# Altium schematic sheet Sheet1.SchDoc
size A4; SheetNumber: 1; SheetTotal: 3
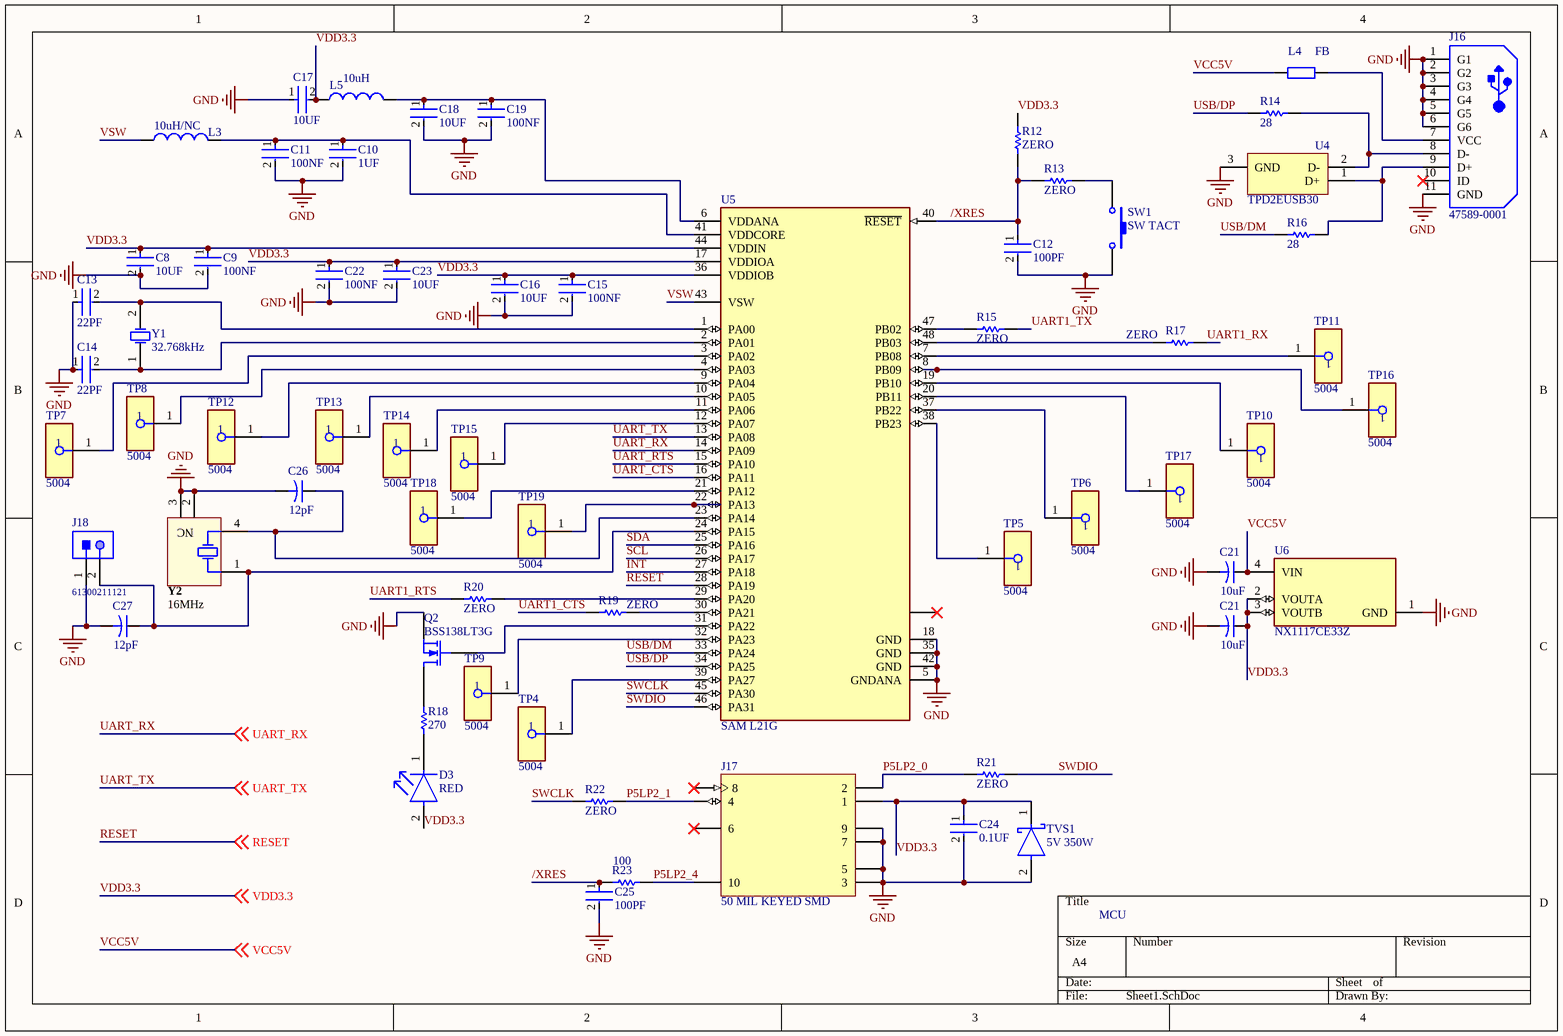
[diagram p0: Sheet1.SchDoc]

## Parts
(Parts that share a designator on the sheet are numbered #1, #2 ... from top to bottom, then left to right.)
10uH/NC  L3  [0402-A]
C8  10UF  [FP-C0805C-DN-MFG]
C9  100NF  [FP-C0805C-DN-MFG]
C10  1UF  [FP-C0805C-DN-MFG]
C11  100NF  [FP-C0805C-DN-MFG]
C12  100PF  [FP-C0805C-DN-MFG]
C13  22PF  [FP-C0805C-DN-MFG]
C14  22PF  [FP-C0805C-DN-MFG]
C15  100NF  [FP-C0805C-DN-MFG]
C16  10UF  [FP-C0805C-DN-MFG]
C17  10UF  [FP-C0805C-DN-MFG]
C18  10UF  [FP-C0805C-DN-MFG]
C19  100NF  [FP-C0805C-DN-MFG]
C21#1  value 10uF  [CAPR5-4X5]  (hidden comment: Cap2)
C21#2  value 10uF  [CAPR5-4X5]  (hidden comment: Cap2)
C22  100NF  [FP-C0805C-DN-MFG]
C23  10UF  [FP-C0805C-DN-MFG]
C24  0.1UF  [FP-C0805C-DN-MFG]
C25  100PF  [FP-C0805C-DN-MFG]
C26  value 12pF  [CAPR5-4X5]  (hidden comment: Cap2)
C27  value 12pF  [CAPR5-4X5]  (hidden comment: Cap2)
D3  RED  [FP-LTST-C190GKT-MFG]
FB  value L4  [AXIAL-0.4]  (hidden comment: Res2)
J16  47589-0001  [MOLX-47589-0001_V]
J17  50 MIL KEYED SMD  [VISH-VCNL4020-GS08_V]
J18  61300211121  [61300211121]
L5  value 10uH  [0402-A]  (hidden comment: Inductor)
Q2  BSS138LT3G  [E3]
R12  ZERO  [RESC1005X40X25NL05T10]
R13  ZERO  [RESC1005X40X25NL05T10]
R14  28  [RESC1005X40X25NL05T10]
R15  ZERO  [RESC1005X40X25NL05T10]
R16  28  [RESC1005X40X25NL05T10]
R17  ZERO  [RESC1005X40X25NL05T10]
R18  270  [RESC1005X40X25NL05T10]
R19  ZERO  [RESC1005X40X25NL05T10]
R20  ZERO  [RESC1005X40X25NL05T10]
R21  ZERO  [RESC1005X40X25NL05T10]
R22  ZERO  [RESC1005X40X25NL05T10]
R23  100  [RESC1005X40X25NL05T10]
SW1  SW TACT  [SPST-2]
TP4  5004  [FP-5004-MFG]
TP5  5004  [FP-5004-MFG]
TP6  5004  [FP-5004-MFG]
TP7  5004  [FP-5004-MFG]
TP8  5004  [FP-5004-MFG]
TP9  5004  [FP-5004-MFG]
TP10  5004  [FP-5004-MFG]
TP11  5004  [FP-5004-MFG]
TP12  5004  [FP-5004-MFG]
TP13  5004  [FP-5004-MFG]
TP14  5004  [FP-5004-MFG]
TP15  5004  [FP-5004-MFG]
TP16  5004  [FP-5004-MFG]
TP17  5004  [FP-5004-MFG]
TP18  5004  [FP-5004-MFG]
TP19  5004  [FP-5004-MFG]
TVS1  5V 350W  [FP-PowerDI123-MFG]
U4  TPD2EUSB30  [DRT0003A]
U5  SAM L21G  [FP-PE-MFG]
U6  NX1117CE33Z  [FP-DZD0004A-MFG]
Y1  32.768kHz  [R38]
Y2  16MHz  [ABRA-ABS25-4_V]

## Nets
GND: C8.2 C9.2 C10.2 C11.2 C12.2 C13.1 C14.1 C15.2 C16.2 C17.1 C18.2 C19.2 C21#1.2 C21#2.2 C22.2 C23.2 C24.2 C25.2 C26.2 C27.2 J16.1(G1) J16.2(G2) J16.3(G3) J16.4(G4) J16.5(G5) J16.6(G6) J16.11(GND) J17.6(9) J17.7 J17.8(5) J17.9(3) J18.1 Q2.3(S) SW1.2 TVS1.2(A) U4.3(GND) U5.5(GNDANA) U5.18(GND) U5.35(GND) U5.42(GND) U6.1(GND) Y2.2 Y2.3
/XRES: C12.1 C25.1 R12.1 R13.1 R23.1 U5.40(~{RESET})
INT: U5.27(PA18)
P5LP2_0: J17.1(2) R21.1
P5LP2_1: J17.2(4) R22.2
P5LP2_4: J17.5(10) R23.2
RESET: U5.28(PA19) ; off-sheet RESET
SCL: U5.26(PA17)
SDA: U5.25(PA16)
SWCLK: R22.1 U5.45(PA30)
SWDIO: R21.2 U5.46(PA31)
UART1_CTS: R19.1
UART1_RTS: R20.1
UART1_RX: R17.2
UART1_TX: R15.2
UART_CTS: U5.16(PA11)
UART_RTS: U5.15(PA10)
UART_RX: U5.14(PA09) ; off-sheet UART_RX
UART_TX: U5.13(PA08) ; off-sheet UART_TX
USB/DM: R16.1 U5.33(PA24)
USB/DP: R14.1 U5.34(PA25)
VCC5V: C21#1.1 FB.1 U6.4(VIN) ; off-sheet VCC5V
VDD3.3: C8.1 C9.1 C15.1 C16.1 C17.2 C21#2.1 C22.1 C23.1 C24.1 D3.2(A) J17.10(1) L5.1 R12.2 TVS1.1(C) U5.17(VDDIOA) U5.36(VDDIOB) U5.44(VDDIN) U6.2(VOUTA) U6.3(VOUTB) ; off-sheet VDD3.3
VSW: 10uH/NC.1 U5.43(VSW)
Net10uH/NC_2: 10uH/NC.2 C10.1 C11.1 U5.41(VDDCORE)
NetC13_2: C13.2 U5.1(PA00) Y1.2(OSC2)
NetC14_2: C14.2 U5.2(PA01) Y1.1(OSC1)
NetC18_1: C18.1 C19.1 L5.2 U5.6(VDDANA)
NetC26_1: C26.1 U5.23(PA14) Y2.4(X2)
NetC27_1: C27.1 J18.2 U5.24(PA15) Y2.1(X1)
NetD3_1: D3.1(C) R18.1
NetFB_2: FB.2 J16.7(VCC)
NetJ16_8: J16.8(D-) R14.2 U4.2(D-)
NetJ16_9: J16.9(D+) R16.2 U4.1(D+)
NetQ2_1: Q2.1(D) R18.2
NetQ2_2: Q2.2(G) U5.31(PA22)
NetR13_2: R13.2 SW1.1
NetR15_1: R15.1 U5.47(PB02)
NetR17_1: R17.1 U5.48(PB03)
NetR19_2: R19.2 U5.30(PA21)
NetR20_2: R20.2 U5.29(PA20)
NetTP4_1: TP4.1 U5.39(PA27)
NetTP5_1: TP5.1 U5.38(PB23)
NetTP6_1: TP6.1 U5.37(PB22)
NetTP7_1: TP7.1 U5.3(PA02)
NetTP8_1: TP8.1 U5.4(PA03)
NetTP9_1: TP9.1 U5.32(PA23)
NetTP10_1: TP10.1 U5.19(PB10)
NetTP11_1: TP11.1 U5.7(PB08)
NetTP12_1: TP12.1 U5.9(PA04)
NetTP13_1: TP13.1 U5.10(PA05)
NetTP14_1: TP14.1 U5.11(PA06)
NetTP15_1: TP15.1 U5.12(PA07)
NetTP16_1: TP16.1 U5.8(PB09)
NetTP17_1: TP17.1 U5.20(PB11)
NetTP18_1: TP18.1 U5.21(PA12)
NetTP19_1: TP19.1 U5.22(PA13)

Not connected (* = marked no-connect by the designer): J16 10(ID)*; J17 3(6)* 4(8)*; U5 49(EP)*

## Notes on the sheet
- MCU
- (in symbol CMP-2000-05037-1) NC

## Library data of the parts
10uH/NC = Inductor: Code_IEC: 1005; Value: 10uH; Published: 8-Jun-2000; LatestRevisionDate: 29-May-2009; LatestRevisionNote: IPC-7351 Footprint Added.; PackageReference: 0402-A; Publisher: Altium Limited; PackageDescription: Chip Inductor; Code_JEITA: 0402
C8-C19 C22-C25 = CMP-2007-00279-2: CAP CER 0.1UF 50V X7R 0805; Manufacturer Part Number: C0805C104K5RACTU; Manufacturer: KEMET; Value: 0.10 μF; Tolerance: 0.1; Temperature Coefficient: 30ppm/°C; Material: Ceramic; Device Class L2: Capacitors; Temperature Range Low: -55°C; Voltage Rating: 50 V; Digikey Description: CAP CER 0.1UF 50V X7R 0805; Category: Cap; ComponentLink2Description: Datasheet; Octopart: https://octopart.com/c0805c104k5ractu-kemet-143926; RoHS: TRUE; ComponentLink2URL: https://content.kemet.com/datasheets/KEM_C1003_C0G_SMD.pdf; Temperature Characteristic: X7R; Temperature: -55°C to +125°C; Height: 0.88mm; Temperature Range High: +125°C; Device Class L1: Passive Components; Automotive: No; Lead Free: Yes; Ipc Land Pattern Name: CAPC200125X78; Device Class L3: Ceramic Capacitors; Mouser Description: Cap Ceramic 0.1uF 50V X7R 10% SMD 2.0 x 1.2 mm 125 C Paper T/R; Capacitance: 0.10 μF; Package: C0805C-DN
C21#1 C21#2 C26 C27 = Cap2: Capacitor; Published: 23-Sep-2002; PackageReference: CAPR5-4X5; Publisher: Altium Limited; PackageDescription: Capacitor; 2 Leads
D3 = CMP-22017-000005-2: LED GREEN CLEAR CHIP SMD; Dominant Wavelength: 569nm; Reverse Voltage: 5V; Lens Color: Colorless; Viewing Angle: 130°; Voltage: 2V; Forward Current: 30mA; Power Dissipation: 100mW; Luminous Intensity: 6mcd; Number of LEDs: 1; Forward Voltage: 2.1V; Wavelength: 565nm; Test Current: 10mA; Min Operating Temperature: -55°C; Lens Style: Clear; Mount: Surface Mount; Width: 0.8mm; Packaging: Tape and Reel; Lens Transparency: Clear; Case Code (Metric): 1608; Depth: 0.8mm; Case Code (Imperial): 0603; Case/Package: 0603; Number of Pins: 2; Max Operating Temperature: 85°C; Lead Free: Lead Free; Number of Elements: 1; Length: 1.6mm; Height: 0.8mm; Package Quantity: 1; Power Rating: 100mW; Radiation Hardening: No; Illumination Color: Green; Color: Green
FB = Res2: Resistor; Published: 8-Jun-2000; LatestRevisionDate: 17-Jul-2002; LatestRevisionNote: Re-released for DXP Platform.; PackageReference: AXIAL-0.4; Publisher: Altium Limited; PackageDescription: Axial Device, Thru-Hole; 2 Leads; 0.4 in Pin Spacing
J16 = CMP-2000-05610-1: Right Angle Female Type AB Micro USB Connector, 30 V, 1.8 A, -30 to 85 degC, RoHS, Tape and Reel; Number of Ports: 1Port; Current Rating: 1.8A; Brand: Molex; Connector Type: MicroUSBTypeABreceptacle; Number of Contacts: 5Contact; Voltage Rating: 30VAC; Color: Black; Product: MicroUSBTypeABConnectors; Package URL: http://www.molex.com/pdm_docs/sd/475890001_sd.pdf; Contact Plating: Gold; Datasheet URL: http://www.molex.com/webdocs/datasheets/pdf/en-us/0475890001_IO_CONNECTORS.pdf; Operating Temperature Range: -20Cto+85C; Termination Style: SMD/SMT; Mounting Angle: Right; Package Reference: 47589-0001; Gender: Female; Package Description: Micro USB Connector, Pitch 0.65 mm, 5 Positions, Body 7.5 x 5.6 mm; Mounting Technology: SurfaceMount; Contact Material: CopperAlloy; Packaging: Reel; RoHS: True; Standard: USB; Manufacturer URL: http://www.molex.com/; Manufacturer: Molex; Datasheet Version: 12/2016; Product Category: USBConnectors; Series: 47589
J17 = CMP-2000-07387-1: Fully Integrated Proximity and Ambient Light Sensor with Infrared Emitter, I2C Interface, and Interrupt Function, 2.5 to 3.6 V, -25 to 85 degC, 10-Pin SMD, RoHS, Tape and Reel; Manufacturer: Vishay; Output Type: I²C; Other Names: VCNL4020-GS08DKR; Featured Product: VCNL4020OpticalSensor; Voltage - Supply: 2.5V~3.6V; Proximity Detection: Yes; Datasheet URL: http://www.vishay.com/docs/83476/vcnl4020.pdf; Supplier Device Package: SMD; Manufacturer URL: http://www.vishay.com/; Mounting Type: SurfaceMount; Type: Ambient; Package / Case: 10-VDFN; Series: -; Package Reference: VCNL4020-GS08; Wavelength: -; Standard Package: 1; Datasheet Version: Rev. 1.5, 08/2014; Packaging: Digi-Reel®; Package Description: 10-Pin Surface Mount Device, Body 4.9 x 2.4 mm; Family: OpticalSensors-AmbientLight,IR,UVSensors; Operating Temperature: -25°C~85°C; Category: Sensors,Transducers; Mounting Technology: SurfaceMount
J18 = CMP-1712-00002-4: THT Vertical Pin Header WR-PHD, Pitch 2.54 mm, Single Row, 2 pins; Manufacturer: Wurth Elektronik; Rated Current: 3A; Gender: Male; Withstanding Voltage: 500VAC; Working Voltage: 250VAC; Pitch: 2.54mm; Contact Resistance: 20mOhm; Pin Number: 2; Mounting Technology: THT; Orientation: Vertical; Operating Temperature: -40to105degC; Packaging: Bag; Publisher: WurthElektronik; Datasheet URL: https://katalog.we-online.de/em/datasheet/6130xx11121.pdf; Manufacturer URL: http://www.we-online.de; Row Number: Single; Package Reference: 61300211121; Part Number: 61300211121
L5 = Inductor: Code_IEC: 1005; Published: 8-Jun-2000; LatestRevisionDate: 29-May-2009; LatestRevisionNote: IPC-7351 Footprint Added.; PackageReference: 0402-A; Publisher: Altium Limited; PackageDescription: Chip Inductor; Code_JEITA: 0402
Q2 = MOSFET-N: N-Channel MOSFET; Published: 8-Jun-2000; LatestRevisionDate: 17-Jul-2002; LatestRevisionNote: Re-released for DXP Platform.; PackageVersion: 1995/1996; PackageReference: E3; Publisher: Altium Limited; PackageDescription: TO, Flat Index; 3 In-Line, Axial Leads; Body Dia. 4.6mm; Lead Dia. 0.5 mm (max)
R12-R23 = CMP-1011-00001-2: Manufacturer: Yageo / Phycomp; Part Number: RC0402JR-070RL
SW1 = SW-PB: Switch; Published: 24-Mar-1999; LatestRevisionDate: 17-Jul-2002; LatestRevisionNote: Re-released for DXP Platform.; PackageReference: SPST-2; Publisher: Altium Limited; PackageDescription: Switch; 2 Leads
TP4-TP19 = CMP-2000-05575-2: PC TEST POINT MINIATURE YELLOW; Manufacturer: Keystone; Number Of Contacts: 1; Is Female: yes; Device Class L1: Connectors; Manufacturer Part Number: 5004; Digikey Description: PC TEST POINT MINIATURE YELLOW; ComponentLink2URL: https://www.keyelco.com/product-pdf.cfm?p=1313; Lead Free: Yes; ComponentLink2Description: Datasheet; Category: Conn; Height: 4.72mm; Octopart: https://octopart.com/5004-keystone-28591; Mouser Description: TEST POINT PC MINI .040"D YELLOW; Device Class L3: unset; Contact Material: Silver; Package: 5004; Automotive: No; Device Class L2: unset; RoHS: TRUE
TVS1 = CMP-2000-07540-2: DIODE SCHOTTKY 200V POWERDI123; Manufacturer: Diodes Inc.; Manufacturer Part Number: DFLS1200-7; Automotive Grade: Grade 0; Peak Reverse Current: 2uA; Capacitance: 23pF; Forward Current: 1A; Value: 23pF; Max Surge Forward Current: 40A; Max Junction Temp: +175°C; Temperature Range Low: -65°C; Mouser Description: Schottky Diodes & Rectifiers SCHOTTKY RECTIFIER; Package: PowerDI123; Footprint Url: https://www.diodes.com/assets/Package-Files/PowerDI123.pdf; Max Repetitive Reverse Voltage: 200V; Device Class L2: Diodes; Temperature Range High: +175°C; Device Class L1: Discrete Semiconductors; ComponentLink2URL: https://www.diodes.com/assets/Datasheets/ds30628.pdf; Category: Diode; Lead Free: Yes; Temperature: -65°C to +175°C; Reverse Voltage: 200V; Height: 1mm; Digikey Description: DIODE SCHOTTKY 200V POWERDI123; RoHS: TRUE; ComponentLink2Description: Datasheet; Device Class L3: Schottky Diodes; Automotive: Yes; Octopart: https://octopart.com/dfls1200-7-diodes+inc.-13134059
U4 = CMP-0326-00046-3: ESD Solution for Super-Speed (6 Gbps) USB 3.0 Interface, 2 Channels, -40 to +85 degC, 3-pin SOT (DRT), Green (Rohs & No Sb/Br); Manufacturer: Texas Instruments; PartNumber: TPD2EUSB30DRTR; Differential Capacitance(pF): 0.01; Breakdown Voltage(Min)(V): 9; HDMI: TRUE; IEC 61000-4-2 Air-Gap(+/- kV): 8; IO Leakage Current(nA): 10; IO Capacitance(Typ)(pF): 0.7; Mounting Technology: Surface Mount; PackageDescription: 3-Flat Lead Plastic Small Outline, 1 x 1 mm (inc leads), 0.35 mm Pitch; IEC 61000-4-2 Contact(+/- kV): 8; USB Super Speed: TRUE; Eco-Plan: Green (RoHS & no Sb/Br); USB High Speed: TRUE; PackageReference: DRT0003A; SubFamily: ESD Solution; USB Full Speed: TRUE; ComponentLink1Description: Datasheet; ComponentLink2URL: SamplesURL:http://www.ti.com/product/tpd2eusb30#samples; PackageVersion: revD, Jun-2008; ComponentLink2Description: URL Link1; 1394 / Firewire: TRUE; ComponentLink1URL: http://www.ti.com/general/docs/lit/getliterature.tsp?genericPartNumber=TPD2EUSB30&fileType=pdf; DatasheetVersion: SLVSAC2C; Serial ATA / eSATA: TRUE
U5 = CMP-06276-000162-1: IC MCU 32BIT 256KB FLASH 48QFN; Core Architecture: ARM; Peripherals: POR; Oscillator Type: Internal; Frequency: 48MHz; Interface: I2C; Number of I/Os: 37; Case/Package: QFN; Memory Type: FLASH; RoHS Compliant: Yes; Packaging: Tape and Reel; Min Operating Temperature: -40°C; Max Operating Temperature: 85°C; Memory Size: 256KB
U6 = CMP-2000-04961-2: TVS DIODE 5.5V 4SOP; Test Current: 10mA; Clamping Voltage: 105.5V; Direction: Unidirectional; Number of Bidirectional Channels: 2; Min Breakdown Voltage: 11V; Interface: LVDS; Leakage Current: 1nA; Min Supply Voltage: 900mV; ESD Protection: Yes; Capacitance: 1.5pF; Element Configuration: Dual; Mount: Surface Mount; Max Supply Voltage: 5.5V; Number of Channels: 2; Package Quantity: 1; Radiation Hardening: No; Width: 1.4mm; Max Operating Temperature: 85°C; RoHS Compliant: Yes; Power Line Protection: Yes; Depth: 1.4mm; Length: 3.04mm; Height: 1.07mm; Min Operating Temperature: -40°C; Breakdown Voltage: 11V; Lead Free: Lead Free; Number of Pins: 4; Case/Package: SOP; Termination: Solder; Packaging: Tape and Reel; Reverse Standoff Voltage: 5.5V; Max Reverse Leakage Current: 1nA; REACH SVHC: No SVHC
Y1 = XTAL: Crystal Oscillator; Published: 8-Jun-2000; LatestRevisionDate: 17-Jul-2002; LatestRevisionNote: Re-released for DXP Platform.; PackageReference: R38; Publisher: Altium Limited; PackageDescription: Crystal, Thru-Hole; 2 Leads; Body 3.1 x 8.2 mm (Dia.xH)
Y2 = CMP-2000-05037-1: Low Frequency Crystal, 32.768 KHz, -40 to 85 degC, 4-Pin SMD, RoHS, Tape and Reel; Load Capacitance: 12.5pF; Tolerance: 20PPM; Brand: ABRACON; ESR: 50kOhms; Case Length: 8mm; Case Width: 3.8mm; Case Height: 2.5mm; RoHS: Details; Product Category: Crystals; Frequency: 32.768kHz; Datasheet Version: May-11; Series: ABS25; Datasheet URL: https://datasheet.ciiva.com/7998/1700987-7998663.pdf; Termination Style: SMD/SMT; Package Reference: ABS25; Dimensions: 3.8mmWx8mmLx2.5mmH; Package / Case: 8mmx3.8mm; Manufacturer: Abracon; Manufacturer URL: http://www.abracon.com/; Mounting Style: SMD/SMT; Package Description: 4-Pin Surface Mount Device, Body 8 x 3.8 mm, Pitch 5.5 mm; Operating Temperature Range: -40Cto+85C; Factory Pack Quantity: 1000; Type: LowFrequencyCrystal; Packaging: Reel